# EAGLE design FTDI board (EAGLE 6.5.0)
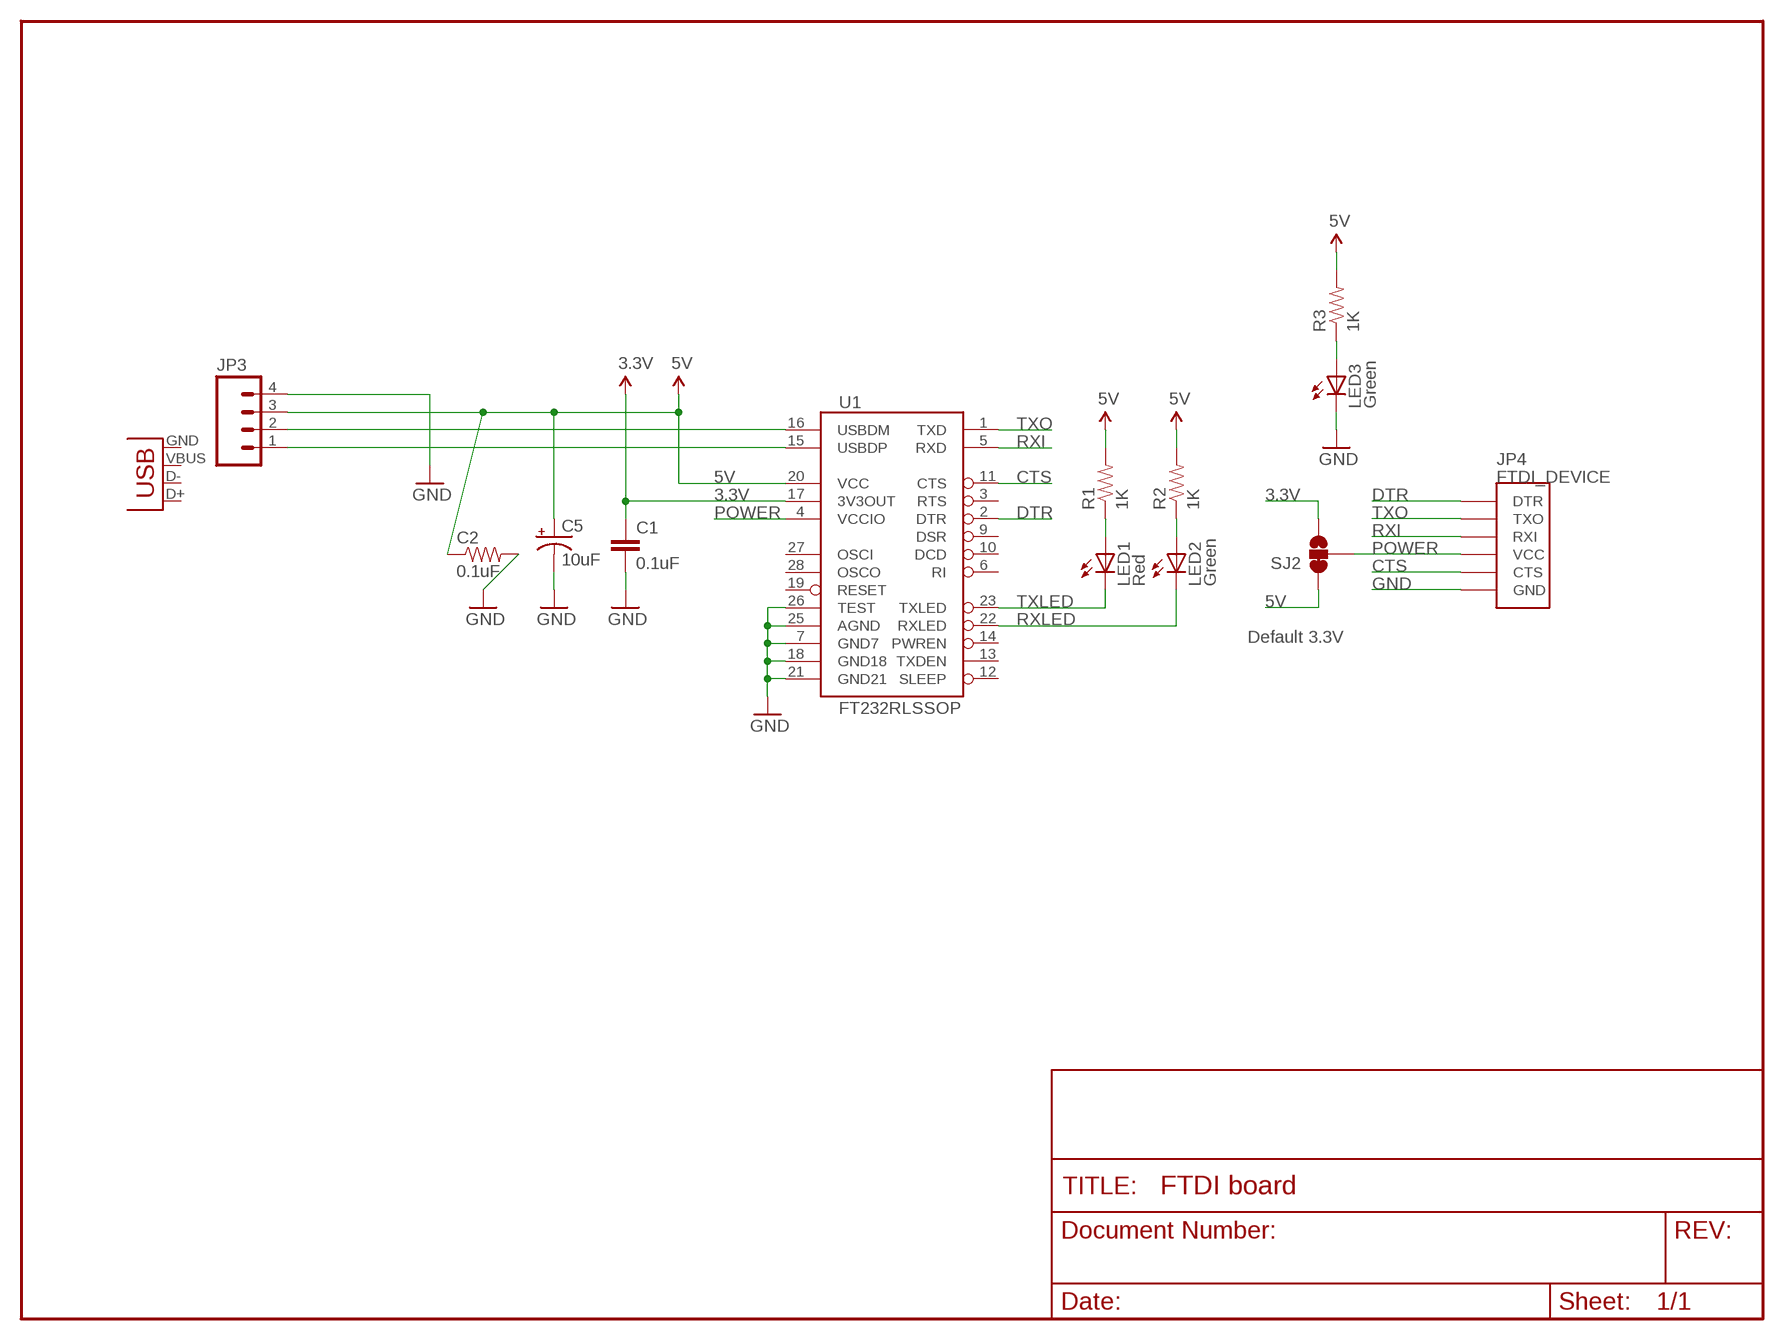
[diagram p0: schematic, sheet 1]

## Parts
C1  0.1uF  CAP0402-CAP  [0402-CAP]
C2  0.1uF  RESISTORPTH-1/4W-VERT  [AXIAL-0.1]
C5  10uF  CAP_POL1206  [EIA3216]
JP3  M04LOCK  [1X04_LOCK]
JP4  FTDI_DEVICE  [FTDI_DEVICE_SIDE]
LED1  Red  LED5MM  [LED5MM]
LED2  Green  LED5MM  [LED5MM]
LED3  Green  LED5MM  [LED5MM]
R1  1K  RESISTORPTH-1/4W-VERT  [AXIAL-0.1]
R2  1K  RESISTORPTH-1/4W-VERT  [AXIAL-0.1]
R3  1K  RESISTORPTH-1/4W-VERT  [AXIAL-0.1]
SJ2  SOLDERJUMPER_2WAYS  [SJ_3]
U1  FT232RLSSOP  [SSOP28DB]
X1  USB-SMD-NS  [USB-MINIB-NOSTOP]

## Nets
3.3V [power]: C1.1 SJ2.3 U1.17(3V3OUT)
5V: C2.P$1 C5.A(+) JP3.3 R1.P$2 R2.P$2 R3.P$2 SJ2.1 U1.20(VCC)
CTS: JP4.P$5(CTS) U1.11(CTS)
DTR: JP4.P$1(DTR) U1.2(DTR)
GND [power]: C1.2 C2.P$2 C5.C(-) JP3.4 JP4.P$6(GND) LED3.K(C) U1.7(GND7) U1.18(GND18) U1.21(GND21) U1.25(AGND) U1.26(TEST)
N$1: LED1.A R1.P$1
N$2: LED2.A R2.P$1
N$3: LED3.A R3.P$1
POWER: JP4.P$4(VCC) SJ2.2 U1.4(VCCIO)
RXI: JP4.P$3(RXI) U1.5(RXD)
RXLED: LED2.K(C) U1.22(RXLED)
TXLED: LED1.K(C) U1.23(TXLED)
TXO: JP4.P$2(TXO) U1.1(TXD)
USB_D+: JP3.1 U1.15(USBDP)
USB_D-: JP3.2 U1.16(USBDM)
Unconnected: U1.3(RTS) U1.6(RI) U1.9(DSR) U1.10(DCD) U1.12(SLEEP) U1.13(TXDEN) U1.14(PWREN) U1.19(RESET) U1.27(OSCI) U1.28(OSCO) X1.D+ X1.D- X1.GND X1.VBUS

## Notes on the sheet
- Default 3.3V

## Library data of the parts
C1 = SparkFun:CAP: Capacitor Standard 0603 ceramic capacitor, and 0.1" leaded capacitor.
C2 R1-R3 = SparkFun-Resistors:RESISTOR: Resistor Basic schematic elements and footprints for 0603, 1206, and PTH resistors.
C5 = SparkFun:CAP_POL: Capacitor Polarized These are standard SMD and PTH capacitors. Normally 10uF, 47uF, and 100uF in electrolytic and tantalum varieties. Always verify the external diameter of the through hole cap, it varies with capacity, voltage, and manufacturer. The EIA devices should be standard.
JP3 = SparkFun-Connectors:M04: Header 4 Standard 4-pin 0.1" header. Use with straight break away headers (SKU : PRT-00116), right angle break away headers (PRT-00553), swiss pins (PRT-00743), machine pins (PRT-00117), and female headers (PRT-00115). Molex polarized connector foot print use with SKU : PRT-08231 with associated crimp pins and housings. 1MM SMD Version SKU: PRT-10208
JP4 = SparkFun-Connectors:FTDI_DEVICE: Connector which mates to FTDI basic or FTDI cable.
LED1-LED3 = SparkFun-LED:LED: LEDs Standard schematic elements and footprints for 5mm, 3mm, 1206, and 0603 sized LEDs. 5mm - Spark Fun Electronics SKU : COM-00529 (and others)
SJ2 = SparkFun:SOLDERJUMPER_2WAY: Solder Jumper 2 way solder jumper
U1 = SparkFun:FT232RL: USB UART FT232RL 4th Generation USB UART (USB <-> Serial) Controller. Spark Fun Electronics SKU : COM-00650
X1 = SparkFun:USB: USB Connectors USB-B-PTH is fully proven SKU : PRT-00139 USB-miniB is fully proven SKU : PRT-00587 USB-A-PCB is untested. USB-A-H is throughly reviewed, but untested. Spark Fun Electronics SKU : PRT-00437 USB-B-SMT is throughly reviewed, but untested. Needs silkscreen touching up. USB-A-S has not been used/tested USB-MB-H has not been used/tested

## Net classes
0 default: width 0.203 mm
1 power: width 0.254 mm

## Board
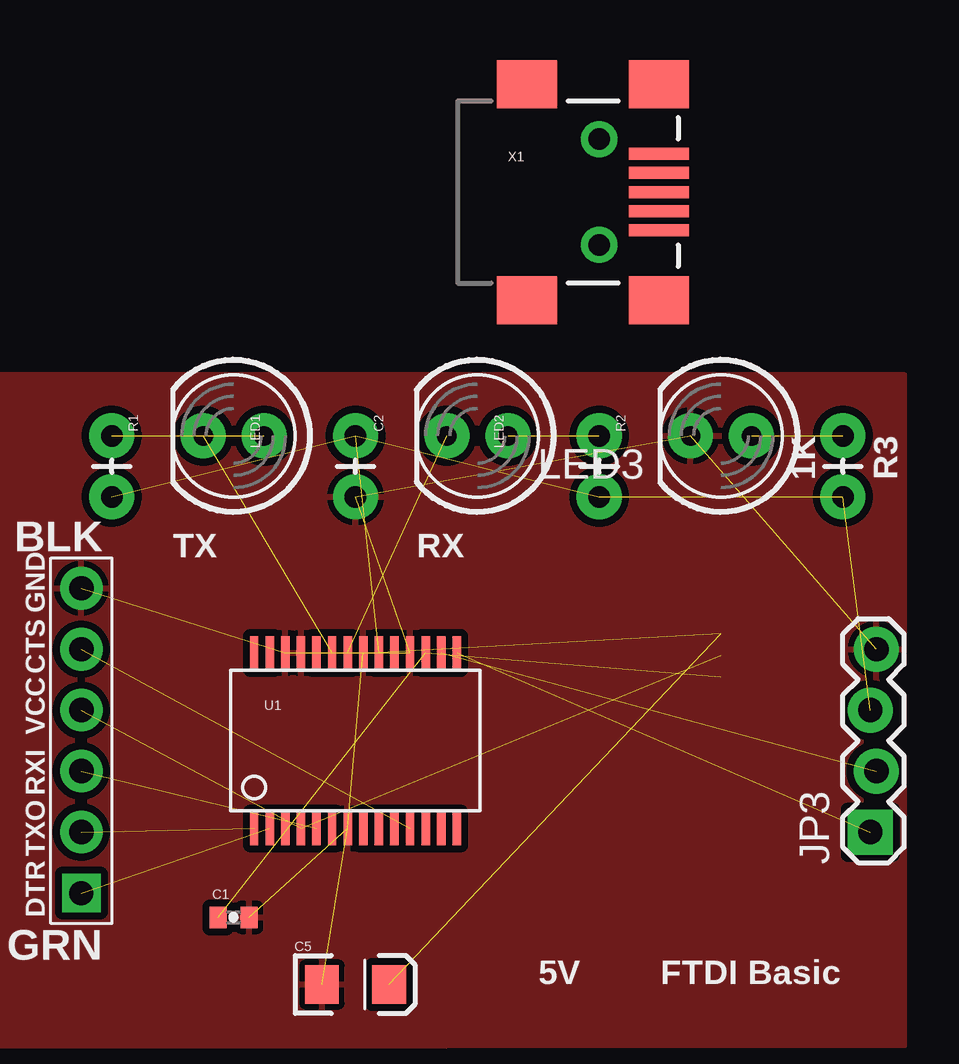
[diagram p1: board, top side]
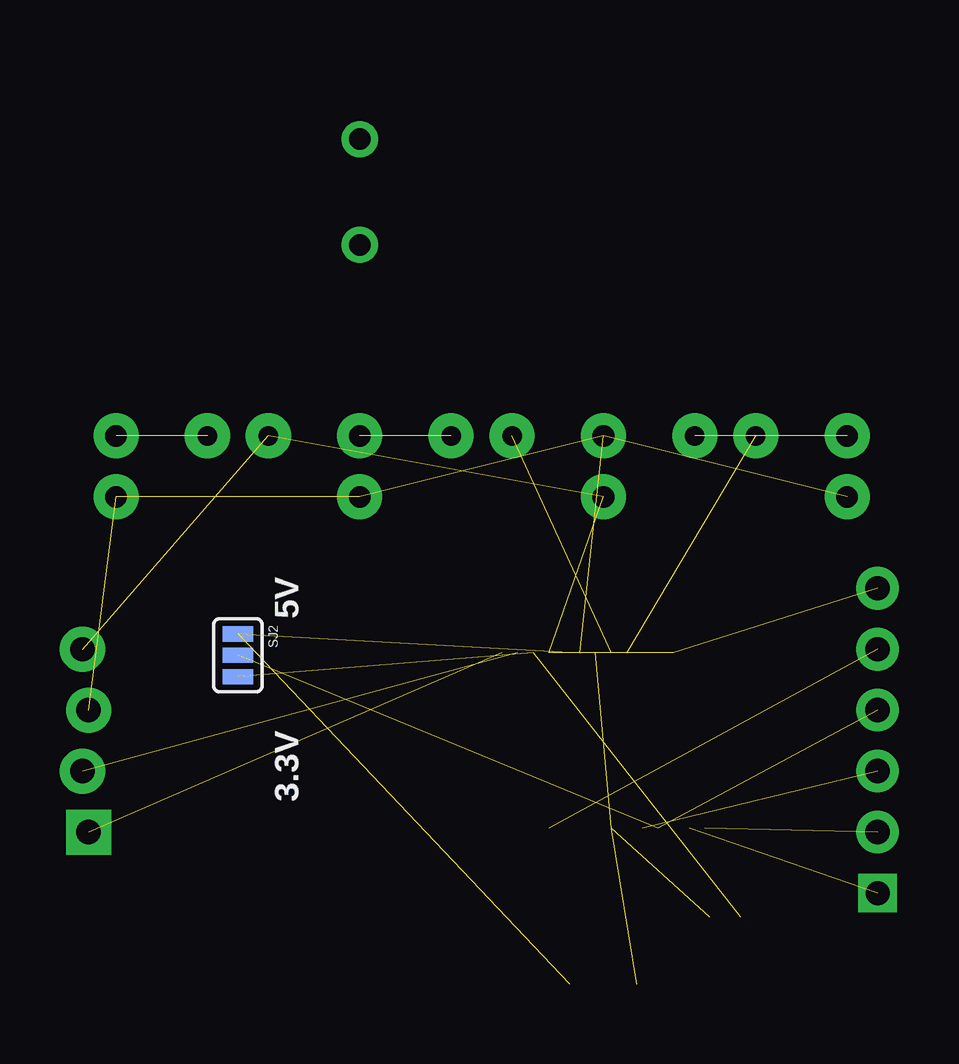
[diagram p2: board, bottom side, seen from below]

No outline drawn. Coordinates in mm, seen from the top.
Copper layers (1*16): Top 0.035mm / dielectric 1.5mm / Bottom 0.035mm
Design rules "SparkFun": minimum track width 8mil, minimum drill 20mil, track to track 8mil, track to pad 8mil, pad to pad 8mil, via to via 8mil, smd to smd 8mil, copper to edge 8mil, drill to drill 8mil, minimum pad ring 12mil, minimum via ring 10mil, stop-mask expansion 4mil, vias tented up to drill 20mil, thermal gap 10mil

### Footprints (pad centres in the part's own frame; a part is rotated, then mirrored left to right if it is on the bottom)
0402-CAP = smd 0.7 x 0.9: 1 -0.65,0; 2 0.65,0
AXIAL-0.1 = drill 0.9 pad 1.88: P$1 0,0; P$2 2.54,0
EIA3216 = smd 1.4 x 1.6: A 1.4,0; C -1.4,0
1X04_LOCK = drill 1.016 pad 1.88 square: 1 0,0.127 | drill 1.016 pad 1.88: 2 2.54,-0.127; 3 5.08,0.127; 4 7.62,-0.127
FTDI_DEVICE_SIDE = drill 1 square: P$1 -6.35,0 | drill 1.016 pad 1.778: P$2 -3.81,0; P$3 -1.27,0; P$4 1.27,0; P$5 3.81,0; P$6 6.35,0
LED5MM = drill 0.813 pad 1.88: A -1.27,0; K 1.27,0
SJ_3 = smd 0.635 x 1.27: 1 -0.889,0; 2 0,0; 3 0.889,0
SSOP28DB = smd 0.348 x 1.397: 1 -4.225,-3.656; 2 -3.575,-3.656; 3 -2.925,-3.656; 4 -2.275,-3.656; 5 -1.625,-3.656; 6 -0.975,-3.656; 7 -0.325,-3.656; 8 0.325,-3.656; 9 0.975,-3.656; 10 1.625,-3.656; 11 2.275,-3.656; 12 2.925,-3.656; 13 3.575,-3.656; 14 4.225,-3.656; 15 4.225,3.656; 16 3.575,3.656; 17 2.925,3.656; 18 2.275,3.656; 19 1.625,3.656; 20 0.975,3.656; 21 0.325,3.656; 22 -0.325,3.656; 23 -0.975,3.656; 24 -1.625,3.656; 25 -2.275,3.656; 26 -2.925,3.656; 27 -3.575,3.656; 28 -4.225,3.656
USB-MINIB-NOSTOP = smd 2.5 x 0.5: D+ 2.5,0; D- 2.5,0.8; GND 2.5,-1.6; ID 2.5,-0.8; VBUS 2.5,1.6 | smd 2.5 x 2: G1 -3,-4.5; G2 -3,4.5; G3 2.5,4.5; G4 2.5,-4.5 | drill 0.9 pad 0.8: H1 0,2.2 | drill 0.9 pad 0.787: H2 0,-2.2

### Placement (x,y rotation side)
C1  10.16,5.33 0 top
C2  15.24,25.4 270 top
C5  15.24,2.54 0 top
JP3  36.83,8.89 90 top
JP4  3.81,12.7 90 top
LED1  10.16,25.4 180 top
LED2  20.32,25.4 180 top
LED3  30.48,25.4 180 top
R1  5.08,25.4 270 top
R2  25.4,25.4 270 top
R3  35.56,25.4 270 top
SJ2  30.48,16.26 270 bottom
U1  15.24,12.7 0 top
X1  25.4,35.56 0 top

### Tracks (layer width: path | path; a pad name or v marks a point on that pad's centre or on a via)
3.3V  (2 unrouted)
5V  (7 unrouted)
CTS  (1 unrouted)
DTR  (1 unrouted)
GND  (10 unrouted)
  pour Top (isolate 0.305): 0,-0.03 0,27.94 38.1,27.94 38.1,0
N$1  (1 unrouted)
N$2  (1 unrouted)
N$3  (1 unrouted)
POWER  (2 unrouted)
RXI  (1 unrouted)
RXLED  (1 unrouted)
TXLED  (1 unrouted)
TXO  (1 unrouted)
USB_D+  (1 unrouted)
USB_D-  (1 unrouted)

### Text on the board
tPlace: TX | RX | 5V | FTDI Basic
bPlace: 5V | 3.3V
tValues: Close